# Altium project PWRMOD-001-RevA.PrjPcb
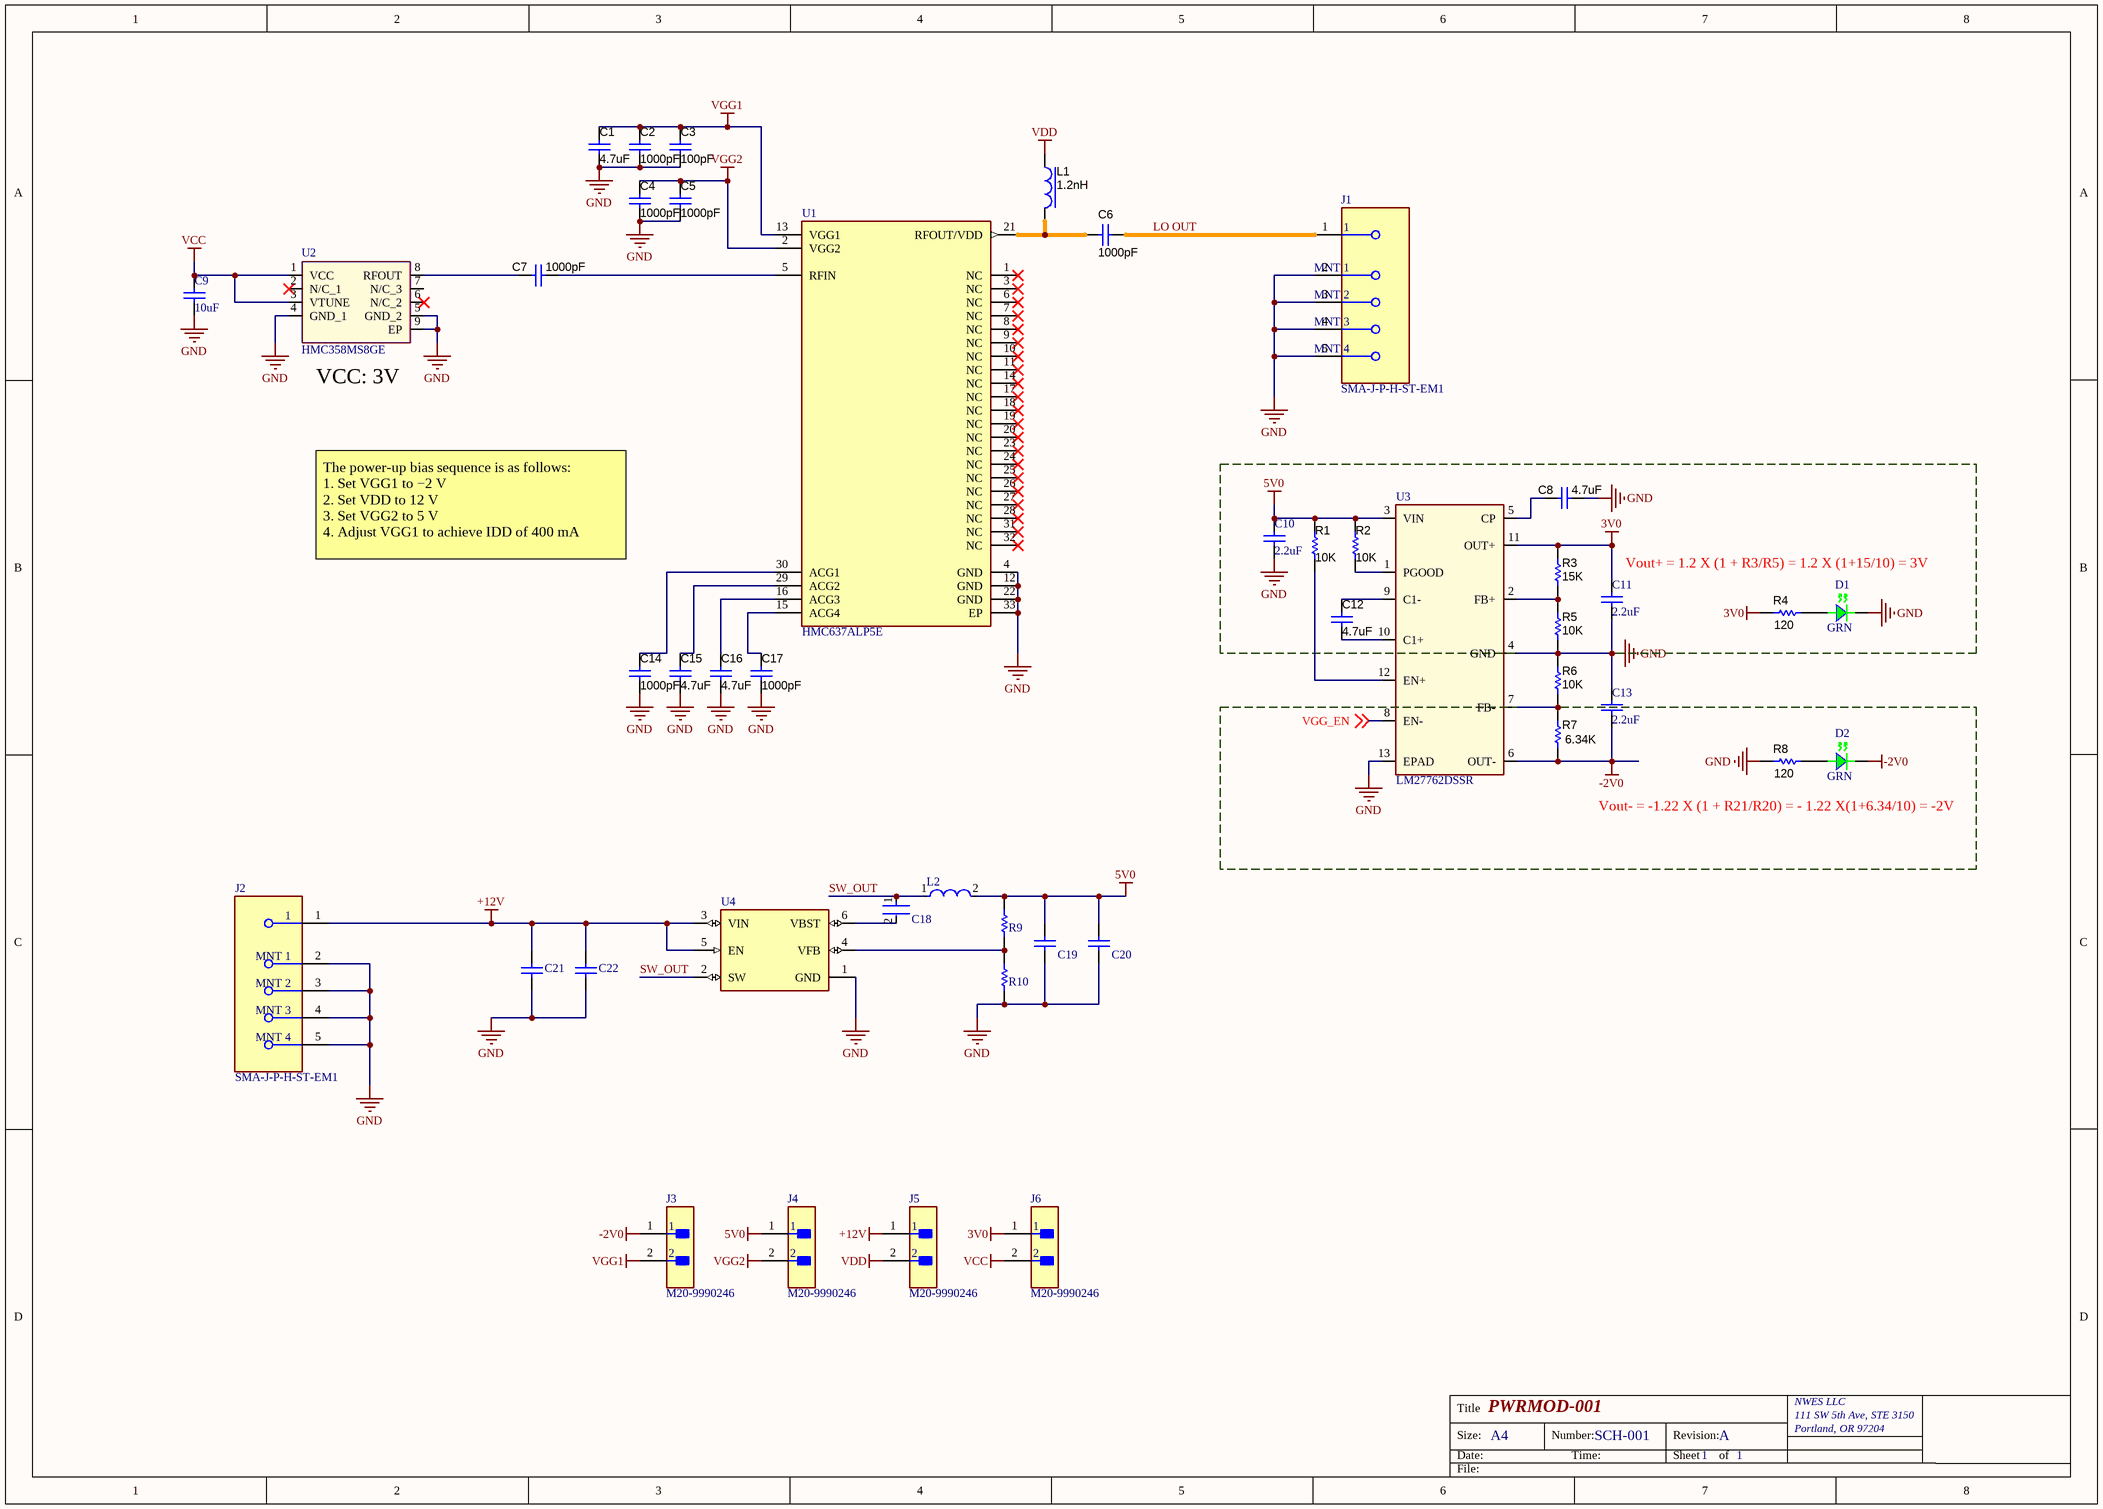
[diagram p0: PWRMOD-001-RevA.SchDoc]
docnumber: SCH-001; ProjectTitle: PWRMOD-001; revnum: A
1 sheet, 46 parts. Net scope: global (net labels, ports and power ports of the same name join across sheets).
Board file: PWRMOD-001-RevA.PcbDoc

## Sheet PWRMOD-001-RevA.SchDoc: =ProjectTitle
size A3; Author: Zachariah Peterson; Organization: NWES LLC; Address1: 111 SW 5th Ave, STE 3150; Address2: Portland, OR 97204; DocumentNumber: SCH-001; Revision: A; SheetNumber: 1; SheetTotal: 1

### Parts
C1  4.7uF  [0402_CAP]
C2  1000pF  [0402_CAP]
C3  100pF  [0402_CAP]
C4  1000pF  [0402_CAP]
C5  1000pF  [0402_CAP]
C6  1000pF  [0402_CAP]
C7  1000pF  [0402_CAP]
C8  4.7uF  [0402_CAP]
C9  10uF  [0402_CAP]
C10  2.2uF  [0402_CAP]
C11  2.2uF  [0402_CAP]
C12  4.7uF  [0402_CAP]
C13  2.2uF  [0402_CAP]
C14  1000pF  [0402_CAP]
C15  4.7uF  [0402_CAP]
C16  4.7uF  [0402_CAP]
C17  1000pF  [0402_CAP]
C18  C0603C104Z3VACTU  [FP-C0603-CG-IPC_B]  (value not drawn)
C19  C1608X5R1A226M080AC  [CAPC1608X100X20ML10]  (value not drawn)
C20  C1608X5R1A226M080AC  [CAPC1608X100X20ML10]  (value not drawn)
C21  GRM31CR61E106KA12L  [CAPC3216X180X55ML20T25]  (value not drawn)
C22  GRM31CR61E106KA12L  [CAPC3216X180X55ML20T25]  (value not drawn)
D1  GRN  [LED_0603]
D2  GRN  [LED_0603]
J1  SMA-J-P-H-ST-EM1  [FP-SMA-J-P-H-ST-EM1-MFG]
J2  SMA-J-P-H-ST-EM1  [FP-SMA-J-P-H-ST-EM1-MFG]
J3  M20-9990246  [FP-M20-9990246-MFG]
J4  M20-9990246  [FP-M20-9990246-MFG]
J5  M20-9990246  [FP-M20-9990246-MFG]
J6  M20-9990246  [FP-M20-9990246-MFG]
L1  1.2nH  [IND_0201]
L2  NRS8030T3R3MJGJ  [FP-NRS8030-MFG]  (value not drawn)
R1  10K  [0402_RES]
R2  10K  [0402_RES]
R3  15K  [0402_RES]
R4  120  [0402_RES]
R5  10K  [0402_RES]
R6  10K  [0402_RES]
R7  6.34K  [0402_RES]
R8  120  [0402_RES]
R9  CRCW020156K2FNED  [RESC0603X28X15NL05T05]  (value not drawn)
R10  ERJ2RKF1002X  [RESC1005X40X25LL05T05]  (value not drawn)
U1  HMC637ALP5E  [FP-HCP-32-1-IPC_A]
U2  HMC358MS8GE  [SOP65P488X110-9N]
U3  LM27762DSSR  [SON50P200X300X80-13N-D]
U4  TPS562201DDCR  [FP-DDC0006A-IPC_C]  (value not drawn)

### Blocks framed on the sheet
Vout+ = 1.2 X (1 + R3/R5) = 1.2 X (1+15/10) = 3V: C8 C10-C12 D1 R1-R5 U3
Vout- = -1.22 X (1 + R21/R20) = - 1.22 X(1+6.34/10) = -2V: D2 R7 R8

### Nets
3V0: C11.2 J6.1 R3.1 R4.1 U3.11(OUT+)
5V0: C10.2 C19.2 C20.2 J4.1 L2.2 R1.1 R2.1 R9.2 U3.3(VIN)
+12V: C21.2 C22.2 J2.1 J5.1 U4.3(VIN) U4.5(EN)
-2V0: C13.1 D2.2(K) J3.1 R7.2 U3.6(OUT-)
GND: C1.1 C2.1 C3.1 C4.1 C5.1 C8.2 C9.1 C10.1 C11.1 C13.2 C14.1 C15.1 C16.1 C17.1 C19.1 C20.1 C21.1 C22.1 D1.2(K) J1.2(MNT_1) J1.3(MNT_2) J1.4(MNT_3) J1.5(MNT_4) J2.2(MNT_1) J2.3(MNT_2) J2.4(MNT_3) J2.5(MNT_4) R5.2 R6.1 R8.1 R10.1 U1.4(GND) U1.12(GND) U1.22(GND) U1.33(EP) U2.4(GND_1) U2.5(GND_2) U2.9(EP) U3.4(GND) U3.13(EPAD) U4.1(GND)
VCC: C9.2 J6.2 U2.1(VCC) U2.3(VTUNE)
VDD: J5.2 L1.1
VGG1: C1.2 C2.2 C3.2 J3.2 U1.13(VGG1)
VGG2: C4.2 C5.2 J4.2 U1.2(VGG2)
LO OUT: C6.1 J1.1
SW_OUT: C18.1 L2.1 U4.2(SW)
VGG_EN: U3.8(EN-) ; off-sheet VGG_EN
NetC6_2: C6.2 L1.2 U1.21(RFOUT/VDD)
NetC7_1: C7.1 U2.8(RFOUT)
NetC7_2: C7.2 U1.5(RFIN)
NetC8_1: C8.1 U3.5(CP)
NetC12_1: C12.1 U3.9(C1-)
NetC12_2: C12.2 U3.10(C1+)
NetC14_2: C14.2 U1.30(ACG1)
NetC15_2: C15.2 U1.29(ACG2)
NetC16_2: C16.2 U1.16(ACG3)
NetC17_2: C17.2 U1.15(ACG4)
NetC18_2: C18.2 U4.6(VBST)
NetD1_1: D1.1(A) R4.2
NetD2_1: D2.1(A) R8.2
NetR1_2: R1.2 U3.12(EN+)
NetR2_2: R2.2 U3.1(PGOOD)
NetR3_2: R3.2 R5.1 U3.2(FB+)
NetR6_2: R6.2 R7.1 U3.7(FB-)
NetR9_1: R9.1 R10.2 U4.4(VFB)

Not connected (* = marked no-connect by the designer): U1 1(NC)* 3(NC)* 6(NC)* 7(NC)* 8(NC)* 9(NC)* 10(NC)* 11(NC)* 14(NC)* 17(NC)* 18(NC)* 19(NC)* 20(NC)* 23(NC)* 24(NC)* 25(NC)* 26(NC)* 27(NC)* 28(NC)* 31(NC)* 32(NC)*; U2 2(N/C_1)* 6(N/C_2)* 7(N/C_3)

### Notes on the sheet
- (near U2) VCC: 3V
- The power-up bias sequence is as follows:
  1. Set VGG1 to −2 V
  2. Set VDD to 12 V
  3. Set VGG2 to 5 V
  4. Adjust VGG1 to achieve IDD of 400 mA
- Title
- Size:
- Date:
- A4
- Number:
- Time:
- Revision:
- Sheet
- of
- File:

### Library data of the parts
C1 C8 C12 C15 C16 = CAP CER 4.7UF 10V X5R 0402: Manufacturer: Samsung Electro-Mechanics; PartNumber: CL05A475MP5NRNC; Supplier 1: Digi-Key; PackageReference: 0402; ComponentLink1Description: Datasheet link; Supplier Part Number 1: 1276-1482-1-ND; Technology: Ceramic; Value: 4.7uF; ComponentLink1URL: http://ds.yuden.co.jp/TYCOMPAS/ut/detail.do?productNo=LMK105BJ104KV-F&fileName=LMK105BJ104KV-F_SS&mode=specSheetDownload
C2 C4-C6 C14 C17 = Capacitor: CAP CER 1000PF 25V X7R 0402; Manufacturer: KEMET; Manufacturer Part Number: C0402C102J3RECAUTO; TaMin_C: -55°C; TaMax_C: 85°C; Supplier 1: Digi-Key; PackageReference: 0402; CompType: Capacitor; ComponentLink1Description: Datasheet link; Technology: Ceramic; Value: 1000pF; ComponentLink1URL: http://ds.yuden.co.jp/TYCOMPAS/ut/detail.do?productNo=LMK105BJ104KV-F&fileName=LMK105BJ104KV-F_SS&mode=specSheetDownload
C3 = Capacitor: CAP CER 100PF 25V X7R 0402; Manufacturer: AVX Corporation; PartNumber: 04023C101KAT2A; TaMin_C: -55°C; TaMax_C: 85°C; Supplier 1: Digi-Key; PackageReference: 0402; CompType: Capacitor; ComponentLink1Description: Datasheet link; Supplier Part Number 1: 478-10080-2-ND; Technology: Ceramic; Value: 100pF; ComponentLink1URL: http://ds.yuden.co.jp/TYCOMPAS/ut/detail.do?productNo=LMK105BJ104KV-F&fileName=LMK105BJ104KV-F_SS&mode=specSheetDownload
C7 = Capacitor: CAP CER 1000PF 50V C0G/NP0 0402; Manufacturer: Murata Electronics; PartNumber: GCM1555C1H102FA16D; TaMin_C: -55°C; TaMax_C: 85°C; Supplier 1: Digi-Key; PackageReference: 0402; CompType: Capacitor; ComponentLink1Description: Datasheet link; Supplier Part Number 1: 490-16461-2-ND; Technology: Ceramic; Value: 1000pF; ComponentLink1URL: http://ds.yuden.co.jp/TYCOMPAS/ut/detail.do?productNo=LMK105BJ104KV-F&fileName=LMK105BJ104KV-F_SS&mode=specSheetDownload
C9 = Cap: CAP CER 10UF 6.3V X5R 0402; Manufacturer: Murata Electronics; PartNumber: GRJ155R60J106ME11D; Supplier 1: Digikey; Supplier Part Number 1: 490-13211-1-ND; Value: 10uF; Package: 0402
C10 C11 C13 = Cap: CAP CER 2.2UF 16V X6S 0402; Manufacturer: TDK Corporation; PartNumber: C1005X6S1C225M050BC; Supplier 1: Digikey; Supplier Part Number 1: 445-9101-2-ND; Value: 2.2uF; Package: 0402
C18 = CMP-2006-03069-2: CAP CER 0.1UF 25V Y5V 0603; Dissipation Factor: 7%; Capacitance: 100nF; Tolerance: 80%; Dielectric Material: Ceramic; Depth: 0.8mm; Voltage Rating (DC): 25V; Number of Pins: 2; Dielectric: Y5V; Lead Pitch: 0.7mm; Construction: Flat; Max Operating Temperature: 85°C; Voltage Rating: 25V; Lead Free: Lead Free; Case/Package: 0603; RoHS Compliant: Yes; Length: 1.6mm; Mount: Surface Mount; Thickness: 0.034inch; Radiation Hardening: No; Case Code (Metric): 1608; Packaging: Tape and Reel; Series: C; Package Quantity: 1; Height: 0.8mm; Min Operating Temperature: -30°C; Termination: SMD/SMT; Width: 0.031inch; Case Code (Imperial): 0603; REACH SVHC: No SVHC; Voltage: 25V
C19 C20 = CMP-2000-05441-1: Chip Capacitor, 22 uF, +/- 20%, 10 V, -55 to 85 degC, 0603 (1608 Metric), RoHS, Tape and Reel; Manufacturer: TDK; PCN Part Number: MLCCPartNumberChange30/Nov/2012; Voltage - Rated: 10V; Product Training Modules: CSeriesGeneralApplicationsSEAT,CCV,andTVCLDesignToolsGuidetoReplacinganElectrolyticCapacitorwithanMLCC; Other Names: 445-9077-1; Design Resources: 20WNon-IsolatedBuckLEDDriverUsingPLLNK460KG; Online Catalog: CSeries,GeneralPurpose; Capacitance: 22µF; Temperature Coefficient: X5R; Kits: 445-9014-KIT-ND-KITMLCC100PF-22UF060310-50V; Packaging: CutTape(CT); Standard Package: 1; Package / Case: 0603(1608Metric); Lead Style: -; Features: -; Ratings: -; Operating Temperature: -55degC~85degC; Applications: GeneralPurpose; Package Reference: 603; Datasheet URL: http://download.siliconexpert.com/pdfs/2015/4/21/15/54/45/779/tdk_/manual/37024850441143360mlcc_commercial_general_en.pdf; Datasheet Version: Mar-15; Mounting Type: SurfaceMount,MLCC; Lead Spacing: -; Size / Dimension: 0.063"Lx0.031"W(1.60mmx0.80mm); Height - Seated (Max): -; Package Description: 2-Pin Surface Mount Device, Body 1.6 x 0.8 mm; Manufacturer URL: http://www.tdk.com/; RoHS Information: RoHSCertificate-MLCC; Tolerance: ±20%; Series: C; Thickness (Max): 0.035"(0.90mm); Family: CeramicCapacitors; Category: Capacitors
C21 C22 = CMP-2000-04947-1: Chip Capacitor, 10 uF, +/- 10%, 25 V, -55 to 85 degC, 1206 (3216 Metric), RoHS, Tape and Reel; Manufacturer: Murata; Case Height: 1.6mm; Voltage Rating DC: 25V; Capacitance: 10uF; Type: GeneralPurposeMLCC; Dielectric: X5R; Case Length: 3.2mm; Brand: MurataElectronics; Maximum Operating Temperature: +85C; Datasheet URL: https://datasheet.ciiva.com/11786/0900766b80ef921d-11786983.pdf; Tolerance: 10%; Case Code - mm: 3216; Datasheet Version: Sep-13; Packaging: Reel; Product Category: MultilayerCeramicCapacitorsMLCC-SMD/SMT; Manufacturer URL: http://www.murata.com/; Factory Pack Quantity: 2000; Minimum Operating Temperature: -55C; Product: GeneralTypeMLCCs; Package Reference: 1206; RoHS: Details; Package / Case: 1206(3216metric); Package Description: 2-Pin Surface Mount Device, Body 3.2 x 1.6 mm; Case Code - in: 1206; Termination Style: SMD/SMT; Series: GRM; Case Width: 1.6mm
D1 D2 = 0603LED_GRN: LED GREEN CLEAR CHIP 0603 SMD; Manufacturer: Kingbright; PartNumber: APTD1608CGCK; Unit Cost, Qty 1: $0.68; Unit Cost, Qty 500: $0.293; Supplier Part Number 1: 754-1545-2-ND; Value: GRN; Supplier 1: Digi-Key
J1 J2 = CMP-02754-000006-1: CONN SMA JACK STR 50OHM EDGE MNT; Dielectric Material: PTFE; Center Contact Plating: Gold; Max Frequency: 6GHz; Body Material: Brass; Voltage Rating: 335V; Impedance: 50R; Package Quantity: 1; Case/Package: SMA; Max Operating Temperature: 125°C; Fastening Type: Threaded; Orientation: Straight; Depth: 13.33mm; RoHS Compliant: Yes; Length: 6.35mm; Insulation Material: Polytetrafluoroethylene; Termination: Solder; Min Operating Temperature: -65°C; Housing Color: Gold; Contact Plating: Gold; Contact Material: Copper; Connector Type: SMA; Mount: Edge; Series: SMA; Packaging: Tray; Body Plating: Gold; Radiation Hardening: No; Manufacturer Part Number: SMA-J-P-H-ST-EM1
J3-J6 = CMP-15831-000009-1: CONN HEADER VERT 2POS 2.54MM; Manufacturer: Harwin; Conn Gender: Male; Conn Orientation: Vertical; Number Of Contacts: 2; Current Rating: 3A; ComponentLink2URL: https://cdn.harwin.com/pdfs/M20-999.pdf; ComponentLink2Description: Datasheet; Package: M20-9990246; Temperature: -40°C to +105°C; Octopart: https://octopart.com/m20-9990246-harwin-2590635; Mouser Description: 2.54mm (0.1") Pitch SIL Vertical PC Tail Pin Header, 6.1mm mating pin height, tin, 2 contacts; Temperature Range High: +105°C; Device Class L1: Connectors; RoHS: TRUE; Automotive: No; Height: 8.99mm; Number Of Rows: 1; Contact Material: Tin,Nickel; Category: Conn; Pitch: 2.54mm; Lead Free: Yes; Digikey Description: CONN HEADER VERT 2POS 2.54MM; Manufacturer Part Number: M20-9990246; Temperature Range Low: -40°C; Device Class L3: unset; Device Class L2: Headers and Wire Housings
L1 = INDUCTOR: FIXED IND 1.2NH 1.1A 40MOHM SMD; PartNumber: LQP03HQ1N2B02D; Manufacturer: Murata Electronics; CompType: Inductor; Value: 1.2nH; ComponentLink1Description: Datasheet link; ComponentLink1URL: http://www.yuden.co.jp/ut/product/category/inductor/BRC2012T2R2MD.pdf; Supplier 1: Digi-Key; Supplier Part Number 1: 490-13874-1-ND
L2 = CMP-14484-000405-1: Inductor Power Shielded Wirewound 3.3uH 20% 100KHz Ferrite 4.2A 24.7mΩ DCR T/R; Current Rating: 4.3A; DC Resistance (DCR): 19mR; Self Resonant Frequency: 50MHz; Height: 3mm; Lead Free: Lead Free; Saturation Current: 4.2A; Termination: SMD/SMT; RoHS Compliant: Yes; Resistor Type: Wirewound; RMS Current (Irms): 4.3A; Series: NRS; Halogen Free: Halogen Free; Shielding: Shielded; Length: 8mm; Max DC Current: 4.2A; Height - Seated (Max): 0.118inch; Radiation Hardening: No; Min Operating Temperature: -25°C; Number of Pins: 2; Core Material: Ferrite; Inductance: 3.3uH; Package Quantity: 1000; REACH SVHC: No SVHC; Test Frequency: 100kHz; Tolerance: 20%; Case/Package: Nonstandard; Inductance Tolerance: 20%; Width: 0.315inch; Mount: Surface Mount; Depth: 8.2mm; Lead Pitch: 5.6mm; Packaging: Tape and Reel; Max Operating Temperature: 125°C
R1 R2 R5 R6 = CMP-0026823-3: RES 10K OHM 1% 1/16W 0402; PartNumber: RMCF0402FT10K0; Manufacturer: Stackpole Electronics Inc; CompType: Resistor; Value: 10K; ValueDisplayed: 10K; PackageReference: 0402; MountType: SMT; Technology: Thick Film; ComponentLink1Description: Datasheet link; ComponentLink1URL: http://www.vishay.com/docs/20035/dcrcwe3.pdf; Supplier 1: Digi-Key; Supplier Part Number 1: RMCF0402FT10K0TR-ND
R3 = CMP-0026823-3: RES SMD 15K OHM 1% 1/16W 0402; PartNumber: RC0402FR-0715KL; Manufacturer: Yageo; CompType: Resistor; Value: 15K; ValueDisplayed: 15K; PackageReference: 0402; MountType: SMT; Technology: Thick Film; ComponentLink1Description: Datasheet link; ComponentLink1URL: http://www.vishay.com/docs/20035/dcrcwe3.pdf; Supplier 1: Digi-Key; Supplier Part Number 1: 311-15.0KLRTR-ND
R4 R8 = RES 120 OHM 1% 1/16W 0402: PartNumber: RC0402FR-07120RL; Manufacturer: Yageo; CompType: Resistor; Value: 120; PackageReference: 0402; Tolerance_%: 1%; MountType: SMT; Technology: Thick Film; ComponentLink1Description: Datasheet link; ComponentLink1URL: http://www.vishay.com/docs/20035/dcrcwe3.pdf; Supplier 1: Digi-Key; Supplier Part Number 1: 311-120LRCT-ND
R7 = RES 6.34K OHM 1% 1/16W 0402: PartNumber: RC0402FR-076K34L; Manufacturer: Yageo; CompType: Resistor; Value: 6.34K; PackageReference: 0402; Tolerance_%: 1%; MountType: SMT; Technology: Thick Film; ComponentLink1Description: Datasheet link; ComponentLink1URL: http://www.vishay.com/docs/20035/dcrcwe3.pdf; Supplier 1: Digi-Key; Supplier Part Number 1: YAG3218CT-ND
R9 = CMP-2004-00723-1: Manufacturer: Vishay Dale; Part Number: CRCW020156K2FNED
R10 = CMP-2000-07588-1: Chip Resistor, 10 KOhm, +/- 1%, 0.1 W, -55 to 155 degC, 0402 (1005 Metric), RoHS, Tape and Reel; Manufacturer: Panasonic; Power Rating: 100mW; Voltage Rating: 50V; Resistance: 10KOhm; Case\/Package: 0402; Temperature Coefficient: 100ppm\/degreesC; RoHSCompliant: True; Lead Free: LeadFree; Package Quantity: 1; Contact Plating: Tin; Length: 1mm; Radiation Hardening: No; REACH SVHC: NoSVHC; Max Operating Temperature: 155degC; Depth: 0.5mm; Case Code (Imperial): 0402; Military Standard: Not; Package Description: 2-Pin Surface Mount Device, Body 1 x 0.5 mm; Termination: SMD/SMT; Case Code (Metric): 1005; Height: 0.35mm; Packaging: TapeandReel; Voltage Rating (DC): 50V; Package Reference: 402; Number of Pins: 2; Tolerance: 1%; Mounting Technology: SurfaceMount; Width: 0.02inch; Mount: SurfaceMount; Datasheet URL: https://industrial.panasonic.com/cdbs/www-data/pdf/RDA0000/AOA0000C304.pdf; Composition: ThickFilm; Datasheet Version: 02/2017; Manufacturer URL: http://www.panasonic.com/; Max Power Dissipation: 100mW; Number of Terminations: 2; Min Operating Temperature: -55degC
U1 = CMP-09142-000117-1: IC MMIC MESFET GAAS 1W 32-QFN; Max Supply Voltage: 14V; Gain: 13dB; Number of Channels: 1; Noise Figure: 5dB; P1dB: 29dBm; Max Power Dissipation: 8.6W; Operating Supply Voltage: 12V; Operating Supply Current: 400mA; Case/Package: QFN; Mount: Surface Mount; Packaging: Tray; Weight: 0.006653oz; Contact Plating: Tin; Min Operating Temperature: -40°C; RoHS Compliant: No; Max Operating Temperature: 85°C; Package Quantity: 50; Lead Free: Contains Lead; Number of Pins: 32; Manufacturer Part Number: HMC637ALP5E
U2 = HMC358MS8GE: IC MMIC AMP VCO BUFFER 8-MSOP; Manufacturer: Analog Devices; Geometry.Height: 1.1mm; PartNumber: HMC358MS8GE; Supplier Part Number 1: 1127-1344-ND; Supplier 1: Digi-Key
U3 = LM27762DSSR: LM27762 LOW-NOISE POSITIVE- AND; Manufacturer: Texas Instruments; Geometry.Height: 0.8mm; Manufacturer Part Number: LM27762DSSR; Mouser Part Number: 595-LM27762DSSR; Supplier 1: Digi-Key; Supplier Part Number 1: 2156-LM27762DSSR-ND
U4 = CMP-04918-000361-1: IC REG BUCK ADJ 2A TSOT23-6; Manufacturer: Texas Instruments; Switching Frequency: 580kHz; Max Input Voltage: 17V; Number of Outputs: 1; Output Voltage: 7V; Output Type: Adjustable; Quiescent Current: 400uA; Min Input Voltage: 4.5V; Mount: Surface Mount; Max Operating Temperature: 125°C; Lead Free: Lead Free; Operating Supply Voltage: 17V; Number of Pins: 6; RoHS Compliant: Yes; Contact Plating: Tin; Min Operating Temperature: -40°C; Case/Package: SOT; Max Output Current: 2A; Manufacturer Part Number: TPS562201DDCR